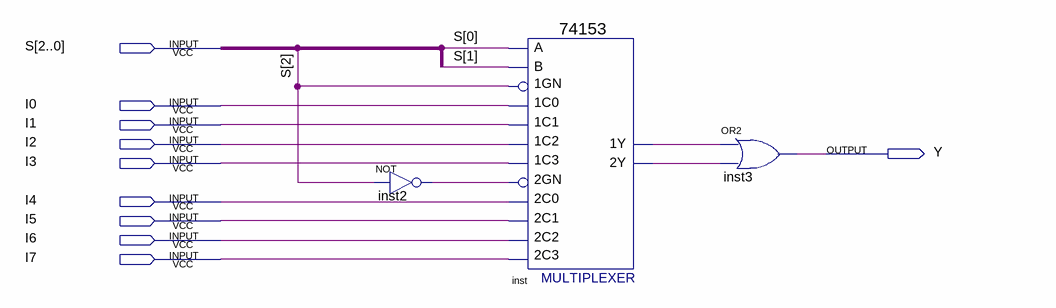
[diagram p0: schematic sheet]
// Quartus schematic Block1.bdf as structural Verilog: 3 symbols, 10 pins
module Block1 (
  input  [2:0] S,
  input  I0,
  input  I1,
  input  I2,
  input  I3,
  input  I4,
  input  I5,
  input  I6,
  input  I7,
  output Y
);

  wire inst2_out, inst_1y, inst_2y;

  not inst2 (inst2_out, S[2]);
  \74153  inst (
    .\1C1 (I1), .\1GN (S[2]), .\1C0 (I0), .\2C0 (I4), .\2GN (inst2_out), .\2C2 (I6), .\1C2 (I2), .\1C3 (I3),
    .B(S[1]), .A(S[0]), .\2C1 (I5), .\2C3 (I7), .\1Y (inst_1y), .\2Y (inst_2y));
  or inst3 (Y, inst_1y, inst_2y);
endmodule
